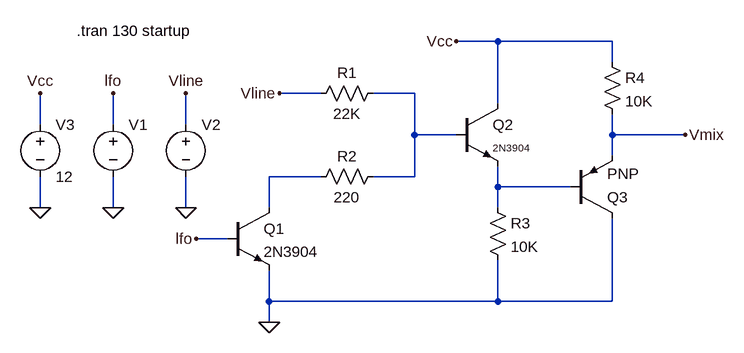
[diagram p0: schematic vline-lfo-mixer.asc]
vline-lfo-mixer.asc, the LTspice schematic file:
Version 4
SHEET 1 1424 868
WIRE 544 -16 480 -16
WIRE 720 -16 544 -16
WIRE 720 16 720 -16
WIRE 272 64 208 64
WIRE 416 64 352 64
WIRE 544 80 544 -16
WIRE -160 112 -160 64
WIRE -48 112 -48 64
WIRE 64 112 64 64
WIRE 416 128 416 64
WIRE 480 128 416 128
WIRE 720 128 720 96
WIRE 832 128 720 128
WIRE 720 160 720 128
WIRE 272 192 192 192
WIRE 416 192 416 128
WIRE 416 192 352 192
WIRE 544 208 544 176
WIRE 656 208 544 208
WIRE -160 240 -160 192
WIRE -48 240 -48 192
WIRE 64 240 64 192
WIRE 192 240 192 192
WIRE 544 240 544 208
WIRE 128 288 80 288
WIRE 192 384 192 336
WIRE 544 384 544 320
WIRE 544 384 192 384
WIRE 720 384 720 256
WIRE 720 384 544 384
WIRE 192 416 192 384
FLAG -48 240 0
FLAG -48 64 lfo
FLAG 64 240 0
FLAG 64 64 Vline
FLAG 208 64 Vline
FLAG 192 416 0
FLAG 80 288 lfo
FLAG -160 240 0
FLAG -160 64 Vcc
FLAG 480 -16 Vcc
FLAG 832 128 Vmix
SYMBOL voltage -48 96 R0
WINDOW 123 0 0 Left 0
WINDOW 39 0 0 Left 0
WINDOW 3 24 96 Invisible 2
SYMATTR Value PULSE(0 .6V .05s 1u 1u 0.5s 1s)
SYMATTR InstName V1
SYMBOL voltage 64 96 R0
WINDOW 123 0 0 Left 0
WINDOW 39 0 0 Left 0
WINDOW 3 24 96 Invisible 2
SYMATTR Value PULSE(0 3.3 10s 5s 10s 35s 60s)
SYMATTR InstName V2
SYMBOL res 368 48 R90
WINDOW 0 0 56 VBottom 2
WINDOW 3 32 56 VTop 2
SYMATTR InstName R1
SYMATTR Value 22K
SYMBOL res 368 176 R90
WINDOW 0 0 56 VBottom 2
WINDOW 3 32 56 VTop 2
SYMATTR InstName R2
SYMATTR Value 220
SYMBOL npn 128 240 R0
SYMATTR InstName Q1
SYMATTR Value 2N3904
SYMBOL npn 480 80 R0
WINDOW 3 56 68 Left 1
SYMATTR Value 2N3904
SYMATTR InstName Q2
SYMBOL res 528 224 R0
SYMATTR InstName R3
SYMATTR Value 10K
SYMBOL voltage -160 96 R0
WINDOW 123 0 0 Left 0
WINDOW 39 0 0 Left 0
SYMATTR InstName V3
SYMATTR Value 12
SYMBOL pnp 656 256 M180
SYMATTR InstName Q3
SYMBOL res 704 0 R0
SYMATTR InstName R4
SYMATTR Value 10K
TEXT -104 -32 Left 2 !.tran 130 startup

The netlist it stands for:
* vline-lfo-mixer.asc
V1 lfo 0 PULSE(0 .6V .05s 1u 1u 0.5s 1s)
V2 Vline 0 PULSE(0 3.3 10s 5s 10s 35s 60s)
R1 N001 Vline 22K
R2 N001 N002 220
Q1 N002 lfo 0 0 2N3904
Q2 Vcc N001 N003 0 2N3904
R3 N003 0 10K
V3 Vcc 0 12
Q3 0 N003 Vmix 0 PNP
R4 Vcc Vmix 10K
.model NPN NPN
.model PNP PNP
.lib standard.bjt
.tran 130 startup
.backanno
.end